# EAGLE design PCCWDController (EAGLE 9.6.2)
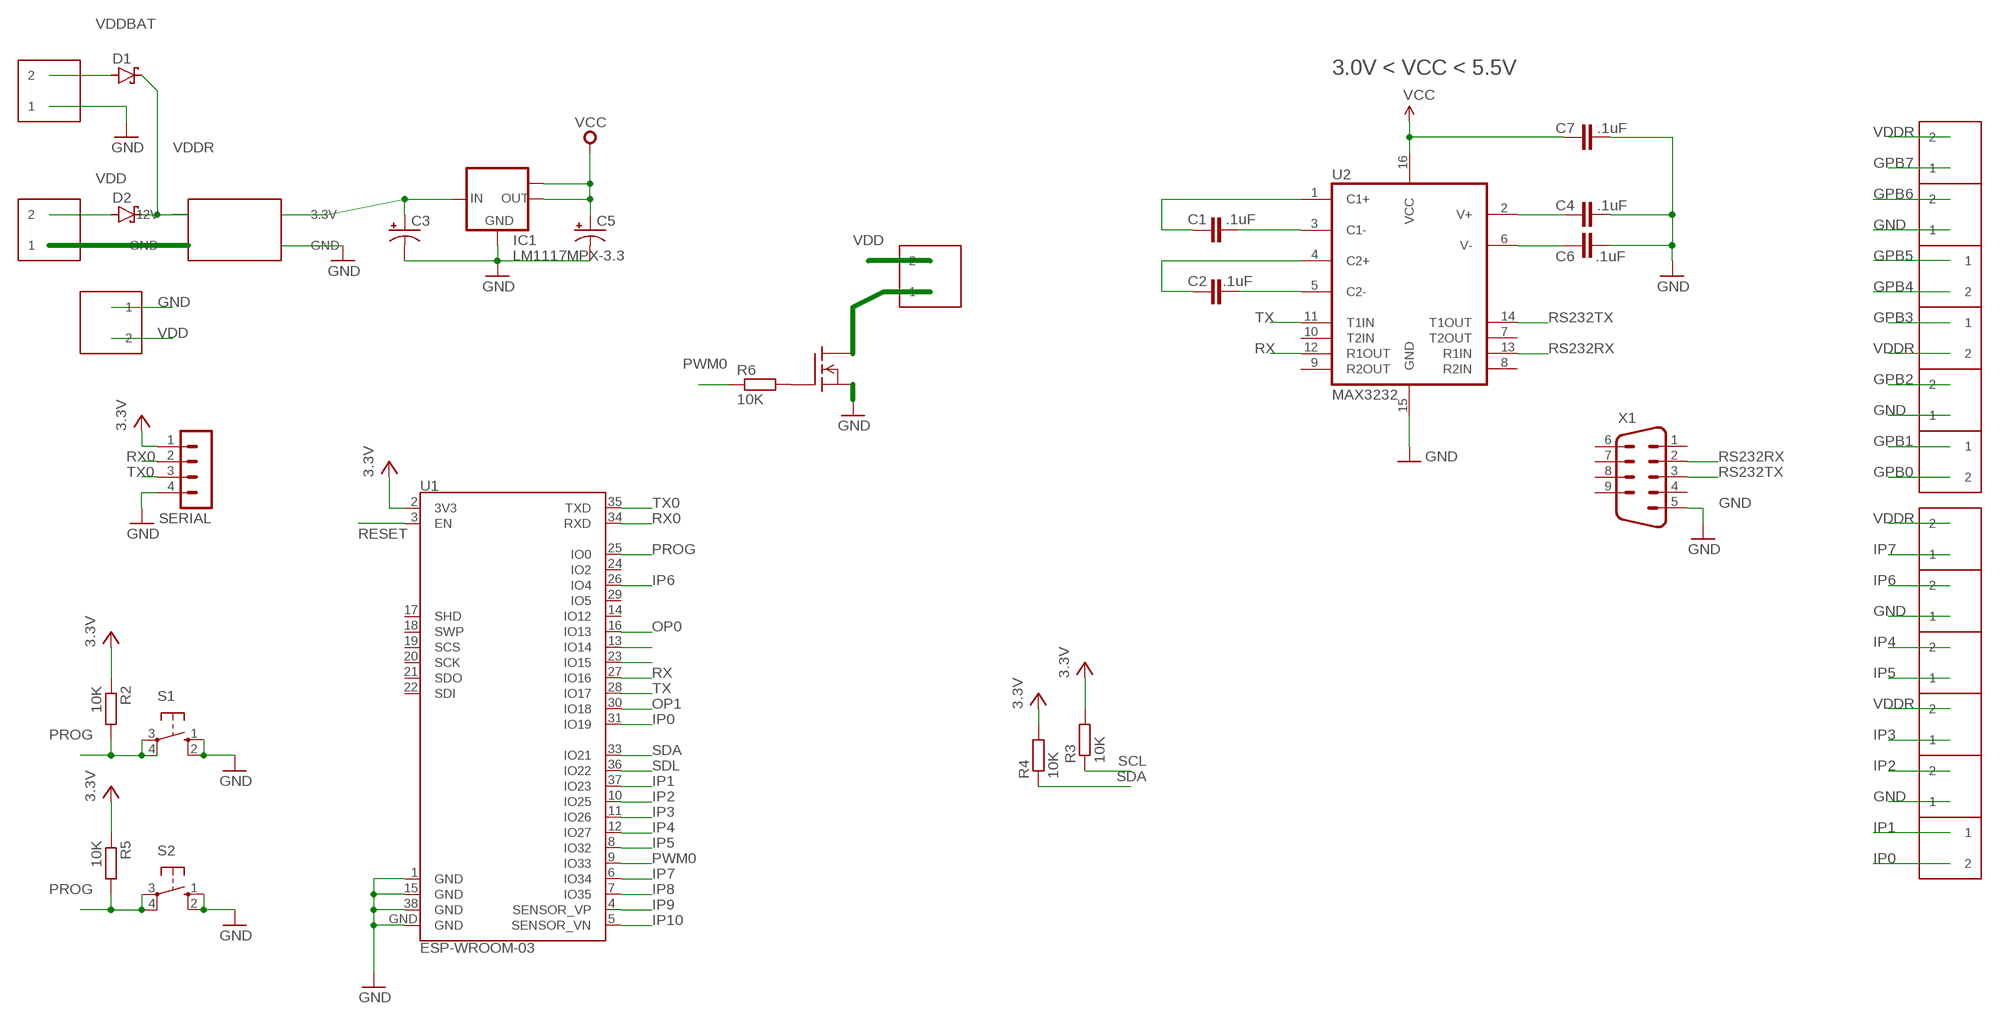
[diagram p0: schematic, sheet 1]

## Parts
C1  .1uF  0.1UF-25V(+80/-20%)(0603)  [0603-CAP]
C2  .1uF  0.1UF-25V(+80/-20%)(0603)  [0603-CAP]
C3  100UF-25V-20%(PTH)  [CPOL-RADIAL-100UF-25V]
C4  .1uF  0.1UF-25V(+80/-20%)(0603)  [0603-CAP]
C5  100UF-25V-20%(PTH)  [CPOL-RADIAL-100UF-25V]
C6  .1uF  0.1UF-25V(+80/-20%)(0603)  [0603-CAP]
C7  .1uF  0.1UF-25V(+80/-20%)(0603)  [0603-CAP]
D1  SCHOTTKY-DIODESMC  [SMC]
D2  SCHOTTKY-DIODESMC  [SMC]
G  FDS5680  [SO-8]
IC1  LM1117MPX-3.3  [SOT223]
PWR1  MP2307-MINI-360  [MP2307-MINI-360]
PWR_IN  KF350-P2  [KF350-2P]
PWR_IN1  KF350-P2  [KF350-2P]
PWR_IN2  KF350-P2  [KF350-2P]
PWR_IN3  KF350-P2  [KF350-2P]
PWR_IN4  KF350-P2  [KF350-2P]
PWR_IN5  KF350-P2  [KF350-2P]
PWR_IN6  KF350-P2  [KF350-2P]
PWR_IN7  KF350-P2  [KF350-2P]
PWR_IN8  KF350-P2  [KF350-2P]
PWR_IN9  KF350-P2  [KF350-2P]
PWR_IN10  KF350-P2  [KF350-2P]
PWR_IN11  KF350-P2  [KF350-2P]
PWR_IN12  KF350-P2  [KF350-2P]
PWR_IN13  KF350-P2  [KF350-2P]
PWR_IN14  KF350-P2  [KF350-2P]
PWR_INBAT  KF350-P2  [KF350-2P]
R2  10K  R-EU_R0603  [R0603]
R3  10K  R-EU_R0603  [R0603]
R4  10K  R-EU_R0603  [R0603]
R5  10K  R-EU_R0603  [R0603]
R6  10K  R-EU_R0603  [R0603]
S1  10-XX  [B3F-10XX]
S2  10-XX  [B3F-10XX]
SERIAL  MA04-1  [MA04-1]
U1  ESP-WROOM-03  [ESP-WROOM-03]
U2  MAX3232  MAX232SOIC16  [SO016]
X1  M09HP  [M09HP]

## Nets
+3V3: C5.1(+) C7.1 IC1.2(OUT) IC1.TAB(OUT1) R2.1 R3.2 R4.2 R5.1 SERIAL.1 U2.16(VCC) ; supply symbol labelled VCC, 3.3V
C1+: C1.1 U2.1(C1+)
C1-: C1.2 U2.3(C1-)
C2+: C2.1 U2.4(C2+)
C2-: C2.2 U2.5(C2-)
DG: G.5(D) G.6(D) G.7(D) G.8(D) PWR_IN1.1
GND: C3.2(-) C4.2 C5.2(-) C6.2 C7.2 G.1(S) G.2(S) G.3(S) IC1.1(GND) PWR1.GND@1(GND) PWR1.GND@2(GND) PWR_IN2.1 PWR_IN5.1 PWR_IN8.1 PWR_IN12.1 PWR_IN14.1 PWR_IN.1 PWR_INBAT.1 S1.1(S) S1.2(S1) S2.1(S) S2.2(S1) SERIAL.4 U1.1(GND) U1.15(GND) U1.38(GND) U1.GND U2.15(GND) X1.5
GPB0: PWR_IN6.2
GPB1: PWR_IN6.1
GPB2: PWR_IN5.2
GPB3: PWR_IN7.1
GPB4: PWR_IN9.2
GPB5: PWR_IN9.1
GPB6: PWR_IN8.2
GPB7: PWR_IN4.1
IP0: PWR_IN11.2 U1.31(IO19)
IP1: PWR_IN11.1 U1.37(IO23)
IP2: PWR_IN12.2 U1.10(IO25)
IP3: PWR_IN13.1 U1.11(IO26)
IP4: PWR_IN3.2 U1.12(IO27)
IP5: PWR_IN3.1 U1.8(IO32)
IP6: PWR_IN2.2 U1.26(IO4)
IP7: PWR_IN10.1 U1.6(IO34)
IP8: U1.7(IO35)
IP9: U1.4(SENSOR_VP)
IP10: U1.5(SENSOR_VN)
N$1: U1.13(IO14)
N$5: G.4(G) R6.2
N$6: U1.23(IO15)
OP0: U1.16(IO13)
OP1: U1.30(IO18)
PROG: R2.2 R5.2 S1.3(P) S1.4(P1) S2.3(P) S2.4(P1) U1.25(IO0)
PWM0: R6.1 U1.9(IO33)
RESET: U1.3(EN)
RS232RX: U2.13(R1IN) X1.2
RS232TX: U2.14(T1OUT) X1.3
RVCC: C3.1(+) IC1.3(IN) PWR1.3.3V
RX: U1.27(IO16) U2.12(R1OUT)
RX0: SERIAL.2 U1.34(RXD)
SCL: R3.1
SDA: R4.1 U1.33(IO21)
SDL: U1.36(IO22)
TX: U1.28(IO17) U2.11(T1IN)
TX0: SERIAL.3 U1.35(TXD)
V+: C4.1 U2.2(V+)
V-: C6.1 U2.6(V-)
VCC: U1.2(3V3) ; supply symbol labelled 3.3V
VDD: D2.A PWR_IN1.2 PWR_IN14.2 PWR_IN.2
VDDBAT: D1.A PWR_INBAT.2
VDDR: D1.C D2.C PWR1.12V PWR_IN4.2 PWR_IN7.2 PWR_IN10.2 PWR_IN13.2
Unconnected: U1.14(IO12) U1.17(SHD) U1.18(SWP) U1.19(SCS) U1.20(SCK) U1.21(SDO) U1.22(SDI) U1.24(IO2) U1.29(IO5) U2.7(T2OUT) U2.8(R2IN) U2.9(R2OUT) U2.10(T2IN) X1.1 X1.4 X1.6 X1.7 X1.8 X1.9

## Notes on the sheet
- 3.0V < VCC < 5.5V

## Library data of the parts
C1 C2 C4 C6 C7 = SparkFun-Capacitors:0.1UF-25V(+80/-20%)(0603): CAP-00810 Ceramic Standard decoupling cap; PROD_ID: CAP-00810; SPARKLE_ID: 918; VALUE: 0.1uF
C3 C5 = SparkFun-Capacitors:100UF-25V-20%(PTH): CAP-08439; PROD_ID: CAP-08439
D1 D2 = diode:SCHOTTKY-DIODE: Schottky Diode
G = transistor-fet:FDS5680: 60V N-Channel PowerTrench TM MOSFET FAIRCHILD FDS5680.pdf
IC1 = lm1117:LM1117MPX-*
PWR1 = MP2307-MINI-360:MP2307-MINI-360
PWR_IN PWR_IN1-PWR_IN14 PWR_INBAT = KF350-P2:KF350-P2
R2-R6 = resistor:R-EU_: RESISTOR, European symbol
S1 S2 = switch-omron:10-XX: OMRON SWITCH; MPN: B3F-1000; OC_FARNELL: 176432; OC_NEWARK: 36M3542
SERIAL = con-lstb:MA04-1: PIN HEADER; OC_FARNELL: unknown; OC_NEWARK: unknown
U1 = esp32:ESP-WROOM-03
U2 = SparkFun-DigitalIC:MAX232: RS232 Transceiver Very common IC. This is generically called 'MAX232', but works with the 3V equivalent MAX3232 generic ICs. Field tested and mother approved. Spark Fun Electronics SKU : COM-00316 (DIP) and COM-00589 (SMD); PROD_ID: IC-08171
X1 = con-subd:M09: HARTING SUB-D

## Net classes
1 +3v3: width 0.406 mm
2 GND: width 0.406 mm

## Board
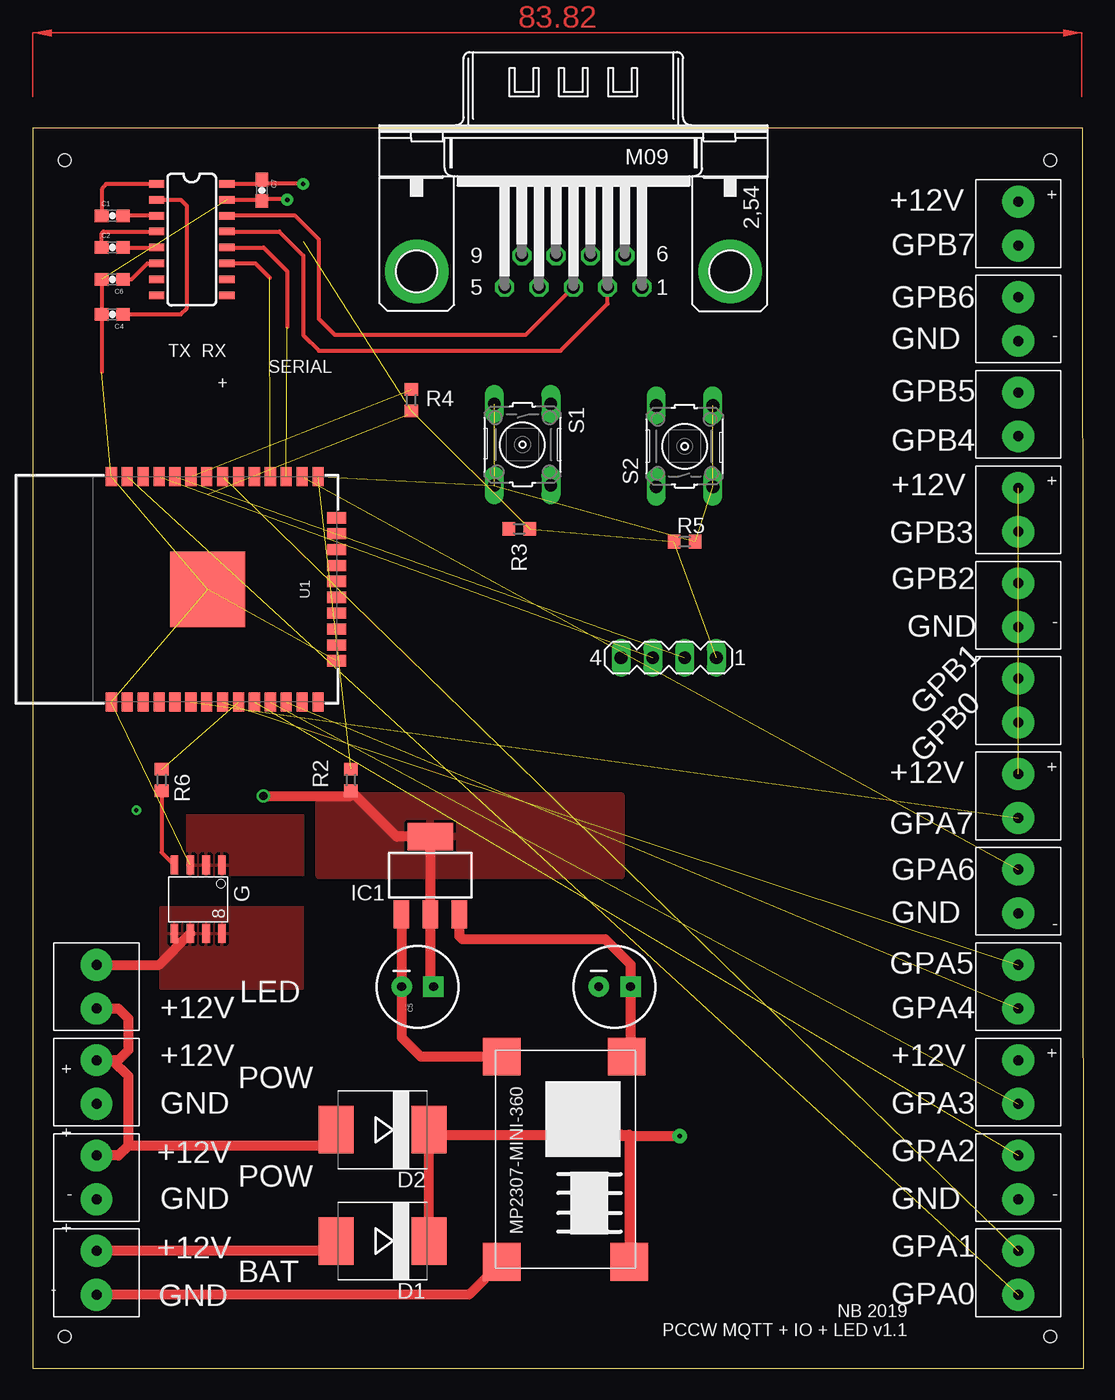
[diagram p1: board, top side]
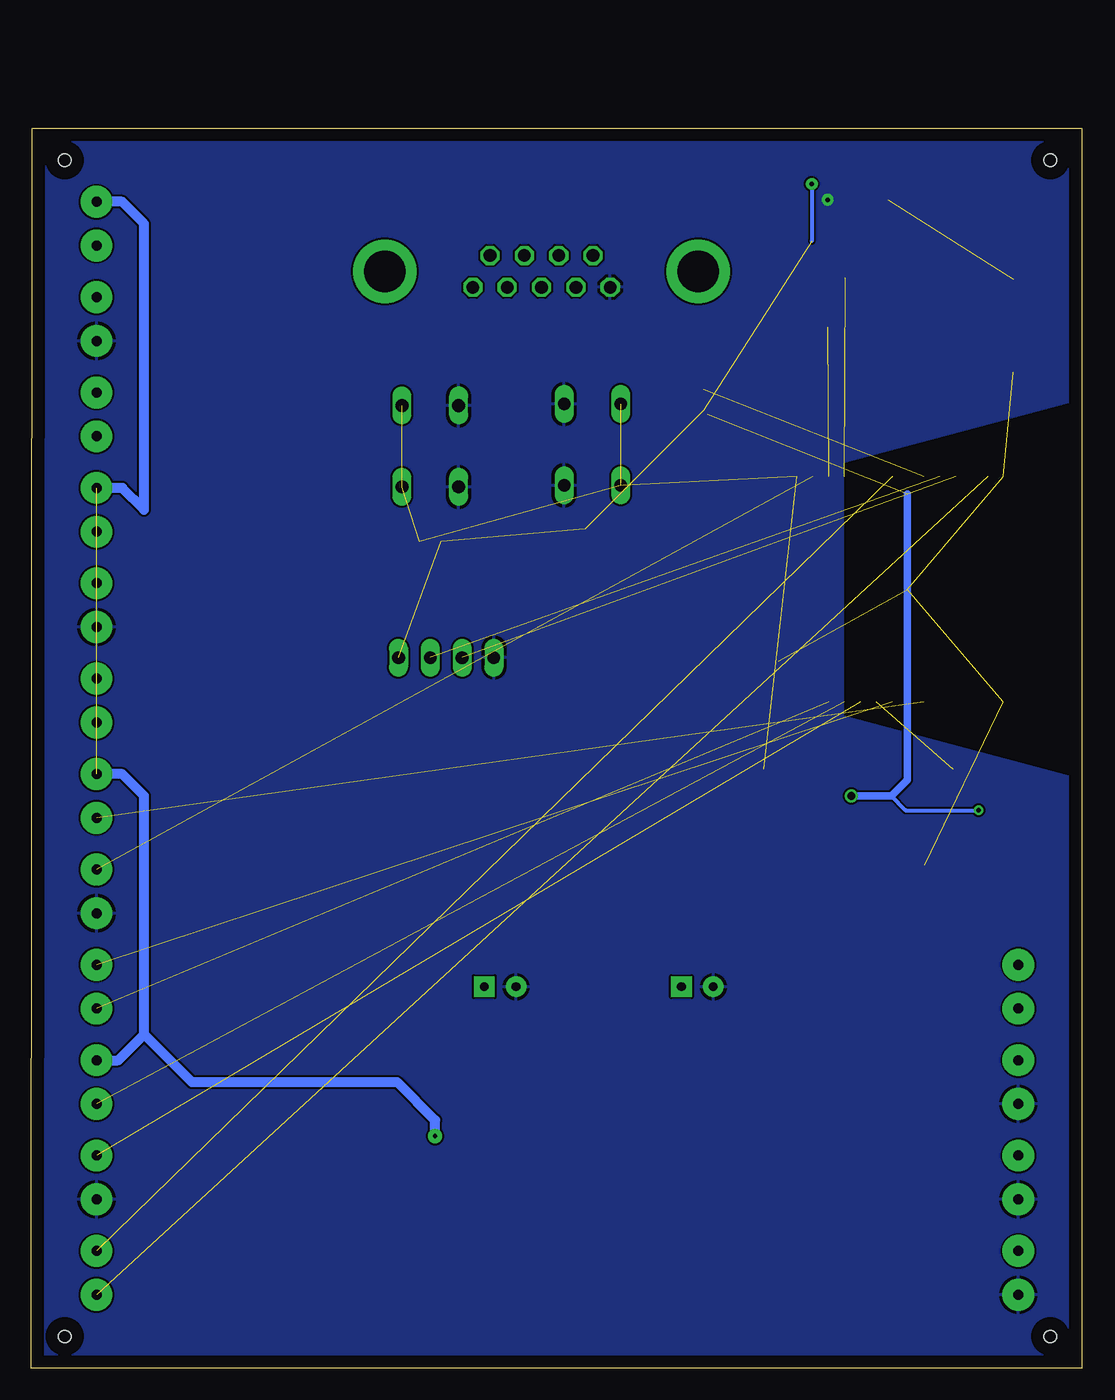
[diagram p2: board, bottom side, seen from below]

Size 83.95 x 99.05 mm. Coordinates in mm from the lower left corner, seen from the top.
Outline: 0,0 83.95,0 83.87,99.05 0,99.05 0,0
Copper layers (1*16): Top 0.035mm / dielectric 1.5mm / Bottom 0.035mm
Design rules "default": minimum track width 6mil, minimum drill 0.35mm, track to track 6mil, track to pad 6mil, pad to pad 6mil, via to via 6mil, smd to smd 6mil, copper to edge 40mil, drill to drill 6mil, minimum pad ring 10mil, minimum via ring 8mil, stop-mask expansion 4mil, vias tented up to drill 0mil, thermal gap 10mil
Holes 1 mm at 2.54,96.52 81.28,96.52 2.54,2.54 81.28,2.54

### Footprints (pad centres in the part's own frame; a part is rotated, then mirrored left to right if it is on the bottom)
0603-CAP = smd 1.1 x 1: 1 -0.85,0; 2 0.85,0
CPOL-RADIAL-100UF-25V = drill 0.7 pad 1.651 square: 1 1.27,0 | drill 0.7 pad 1.651: 2 -1.27,0
SMC = smd 2.8 x 3.8: A 3.7,0; C -3.7,0
SO-8 = smd 1.524 x 0.61: 1 -2.743,1.905; 2 -2.743,0.635; 3 -2.743,-0.635; 4 -2.743,-1.905; 5 2.743,-1.905; 6 2.743,-0.635; 7 2.743,0.635; 8 2.743,1.905
SOT223 = smd 1.219 x 2.235: 1 -2.311,-3.099; 2 0,-3.099; 3 2.311,-3.099 | smd 3.6 x 2.2: TAB 0,3.099
MP2307-MINI-360 = smd 3 x 3: 3.3V 0.5,10.5; 12V 16.9,10.7; GND@1 16.9,0.5; GND@2 0.5,0.5
KF350-2P = drill 0.8 pad 2.54: 1 -1.75,0; 2 1.75,0
R0603 = smd 1 x 1.1: 1 -0.85,0; 2 0.85,0
B3F-10XX = drill 1.016 long: 1 -3.251,2.261; 2 3.251,2.261; 3 -3.251,-2.261; 4 3.251,-2.261
MA04-1 = drill 1.016 long: 1 -3.81,0; 2 -1.27,0; 3 1.27,0; 4 3.81,0
ESP-WROOM-03 = smd 0.9 x 1.5: 1 7.7,9; 2 6.43,9; 3 5.16,9; 4 3.89,9; 5 2.62,9; 6 1.35,9; 7 0.08,9; 8 -1.19,9; 9 -2.46,9; 10 -3.73,9; 11 -5,9; 12 -6.27,9; 13 -7.54,9; 14 -8.81,9; 25 -8.81,-9; 26 -7.54,-9; 27 -6.27,-9; 28 -5,-9; 29 -3.73,-9; 30 -2.46,-9; 31 -1.19,-9; 32 0.08,-9; 33 1.35,-9; 34 2.62,-9; 35 3.89,-9; 36 5.16,-9; 37 6.43,-9; 38 7.7,-9 | smd 1.5 x 0.9: 15 -10.3,5.715; 16 -10.3,4.445; 17 -10.3,3.175; 18 -10.3,1.905; 19 -10.3,0.635; 20 -10.3,-0.635; 21 -10.3,-1.905; 22 -10.3,-3.175; 23 -10.3,-4.445; 24 -10.3,-5.715 | smd 6 x 6: GND 0,0
SO016 = smd 0.6 x 1.2: 1 -4.445,-2.8; 2 -3.175,-2.8; 3 -1.905,-2.8; 4 -0.635,-2.8; 5 0.635,-2.8; 6 1.905,-2.8; 7 3.175,-2.8; 8 4.445,-2.8; 9 4.445,2.8; 10 3.175,2.8; 11 1.905,2.8; 12 0.635,2.8; 13 -0.635,2.8; 14 -1.905,2.8; 15 -3.175,2.8; 16 -4.445,2.8
M09HP = drill 1.016 octagon: 1 5.486,-1.27; 2 2.743,-1.27; 3 0,-1.27; 4 -2.743,-1.27; 5 -5.486,-1.27; 6 4.115,1.27; 7 1.372,1.27; 8 -1.372,1.27; 9 -4.115,1.27 | drill 3.302 pad 5.08: G1 12.522,0; G2 -12.522,0

### Placement (x,y rotation side)
C1  6.35,92.08 0 top
C2  6.35,89.53 0 top
C3  46.48,30.48 0 top
C4  6.35,84.2 180 top
C5  30.73,30.48 0 top
C6  6.35,87 180 top
C7  18.29,94.11 270 top
D1  27.94,10.16 180 top
D2  27.94,19.05 180 top
G  13.21,37.47 270 top
IC1  31.75,39.37 0 top
PWR1  36.96,25.4 270 top
PWR_IN  5.08,15.24 90 top
PWR_IN1  5.08,30.48 270 top
PWR_IN2  78.74,38.1 90 top
PWR_IN3  78.74,30.48 270 top
PWR_IN4  78.74,91.44 90 top
PWR_IN5  78.74,60.96 90 top
PWR_IN6  78.74,53.34 270 top
PWR_IN7  78.74,68.58 90 top
PWR_IN8  78.74,83.82 90 top
PWR_IN9  78.74,76.2 270 top
PWR_IN10  78.74,45.72 90 top
PWR_IN11  78.74,7.62 90 top
PWR_IN12  78.74,15.24 90 top
PWR_IN13  78.74,22.86 90 top
PWR_IN14  5.08,22.86 90 top
PWR_INBAT  5.08,7.62 90 top
R2  25.4,46.99 90 top
R3  38.86,67.06 0 top
R4  30.23,77.34 270 top
R5  52.07,66.04 0 top
R6  10.29,46.99 270 top
S1  39.12,73.79 270 top
S2  52.07,73.66 90 top
SERIAL  50.8,56.77 180 top
U1  13.97,62.23 180 top
U2  12.7,90.17 270 top
X1  43.18,87.63 0 top

### Tracks (layer width: path | path; a pad name or v marks a point on that pad's centre or on a via)
+3V3  (via drill 0.35, 0.35 pad 0.95, 0.65 pad 0.65)  (5 unrouted)
  Top 0.305: 29.93,76.2 R4.2 | v21.59,94.61 18.63,94.61 C7.1 17.95,94.61 U2.16
  Top 0.61: 18.32,45.81 v18.41,45.72
  Top 0.813: C5.1 31.75,30.73 IC1.2 IC1.TAB 29.07,42.47 R2.1 25.4,45.72 v18.41,45.72
  Bottom 0.305: v8.25,44.58 14.1,44.58 15.24,45.72 | v21.59,94.61 21.59,90.04
  Bottom 0.61: 13.97,69.85 13.97,46.99 15.24,45.72 v18.41,45.72
  pour Top: 22.86,45.72 46.99,45.72 46.99,39.37 22.86,39.37
C1+
  Top 0.305: U2.1 5.86,94.61 5.5,94.18 C1.1
C1-
  Top 0.305: U2.3 C1.2
C2+
  Top 0.305: U2.4 5.63,90.8 5.5,90.68 C2.1
C2-
  Top 0.305: C2.2 U2.5
DG
  Top 0.813: PWR_IN1.1 10.08,32.23 G.6
  pour Top: 10.16,36.83 10.16,30.35 21.59,30.35 21.59,36.83
GND  (via drill 0.35 pad 0.95)  (6 unrouted)
  Top 0.152: 29.44,30.51 C5.2
  Top 0.305: U2.15 18.2,93.34 C7.2 18.41,93.38 20.28,93.38 v20.32,93.34 | C6.2 C4.2 5.5,79.59
  Top 0.813: IC1.1 29.44,30.51 | C5.2 29.46,26.42 30.98,24.9 PWR1.GND@2 | PWR1.GND@1 34.83,5.87 PWR_INBAT.1
  pour Bottom: 0,99.06 83.82,99.06 83.82,0 0,0 0,46.99 19.05,52.07 19.05,72.39 0,77.47
  pour Top: 12.32,44.2 21.59,44.2 21.59,39.37 12.32,39.37
GPB4
  Top 0.152: PWR_IN9.2
GPB5
  Top 0.152: 78.69,77.83 PWR_IN9.1
GPB6
  Top 0.152: 78.69,85.45 PWR_IN8.2
IP0  (1 unrouted)
  Bottom 0.152: 78.71,9.4 PWR_IN11.2
IP1  (1 unrouted)
IP2  (1 unrouted)
IP3  (1 unrouted)
IP4  (1 unrouted)
IP5  (1 unrouted)
IP6  (1 unrouted)
IP7  (1 unrouted)
N$5
  Top 0.305: R6.2 10.29,41.22 G.4
PROG  (6 unrouted)
  Top 0.152: R2.2 25.42,47.87
PWM0  (1 unrouted)
RS232RX
  Top 0.305: X1.2 45.92,85.04 42.16,81.28 22.86,81.28 21.59,82.55 21.59,88.9 19.69,90.8 U2.13
RS232TX
  Top 0.305: X1.3 39.37,82.55 24.13,82.55 22.86,83.82 22.86,90.17 20.95,92.08 U2.14
RVCC
  Top 0.813: IC1.3 34.06,34.52 34.29,34.29 45.72,34.29 47.75,32.26 C3.1 47.75,25.2 PWR1.3.3V
RX  (1 unrouted)
  Top 0.305: U2.12 18.41,89.53 20.32,87.63 20.32,83.19
RX0  (1 unrouted)
SDA  (1 unrouted)
  Top 0.305: R4.1 30.23,78.47
TX  (1 unrouted)
  Top 0.305: U2.11 17.78,88.27 18.92,87.12
TX0  (1 unrouted)
V+
  Top 0.305: U2.2 11.81,93.34 12.32,92.84 12.32,84.71 11.81,84.2 C4.1
V-
  Top 0.305: C6.1 7.87,87 9.14,88.27 U2.6
VDD
  Top 0.813: PWR_IN1.2 6.83,28.73 7.62,27.94 7.62,25.4 6.83,24.61 6.35,24.61 | PWR_IN14.2 6.35,24.61 | 6.35,24.61 7.62,23.34 7.62,17.78 | 7.62,17.78 6.83,16.99 PWR_IN.2 | D2.A 22.97,17.78 7.62,17.78
VDDBAT
  Top 0.813: PWR_INBAT.2 5.11,9.4 23.48,9.4 D1.A
VDDR  (via drill 0.35 pad 1.15)  (1 unrouted)
  Top 0.813: D1.C D2.C 32.03,18.66 46.99,18.66 | PWR1.12V 47.66,18.66 46.99,18.66 | v51.69,18.54 47.11,18.54 46.99,18.66
  Bottom 0.813: PWR_IN13.2 76.99,24.61 74.93,26.67 | 74.93,26.67 74.93,45.72 76.68,47.47 PWR_IN10.2 | PWR_IN7.2 76.68,70.33 74.93,68.58 74.93,91.44 76.68,93.19 PWR_IN4.2 | v51.69,18.54 51.69,19.81 54.74,22.86 71.12,22.86 74.93,26.67
(copper drawn outside any net)
  shapes: Top area x2

### Text on the board
tPlace: + | - | TX | RX | SERIAL | + | + | - | + | - | LED | + | + | POW | + | POW | - | - | + | BAT | - | NB 2019 / PCCW MQTT + IO + LED v1.1
tNames: +12V | GPB7 | GPB6 | GND | GPB5 | GPB4 | +12V | GPB3 | GPB2 | GND | GPB1 | GPB0 | +12V | GPA7 | GPA6 | GND | GPA5 | +12V | GPA4 | +12V | +12V | GND | GPA3 | GPA2 | +12V | GND | GND | +12V | GPA1 | GND | GPA0